# EAGLE schematic swarmbot (EAGLE 9.4.2)
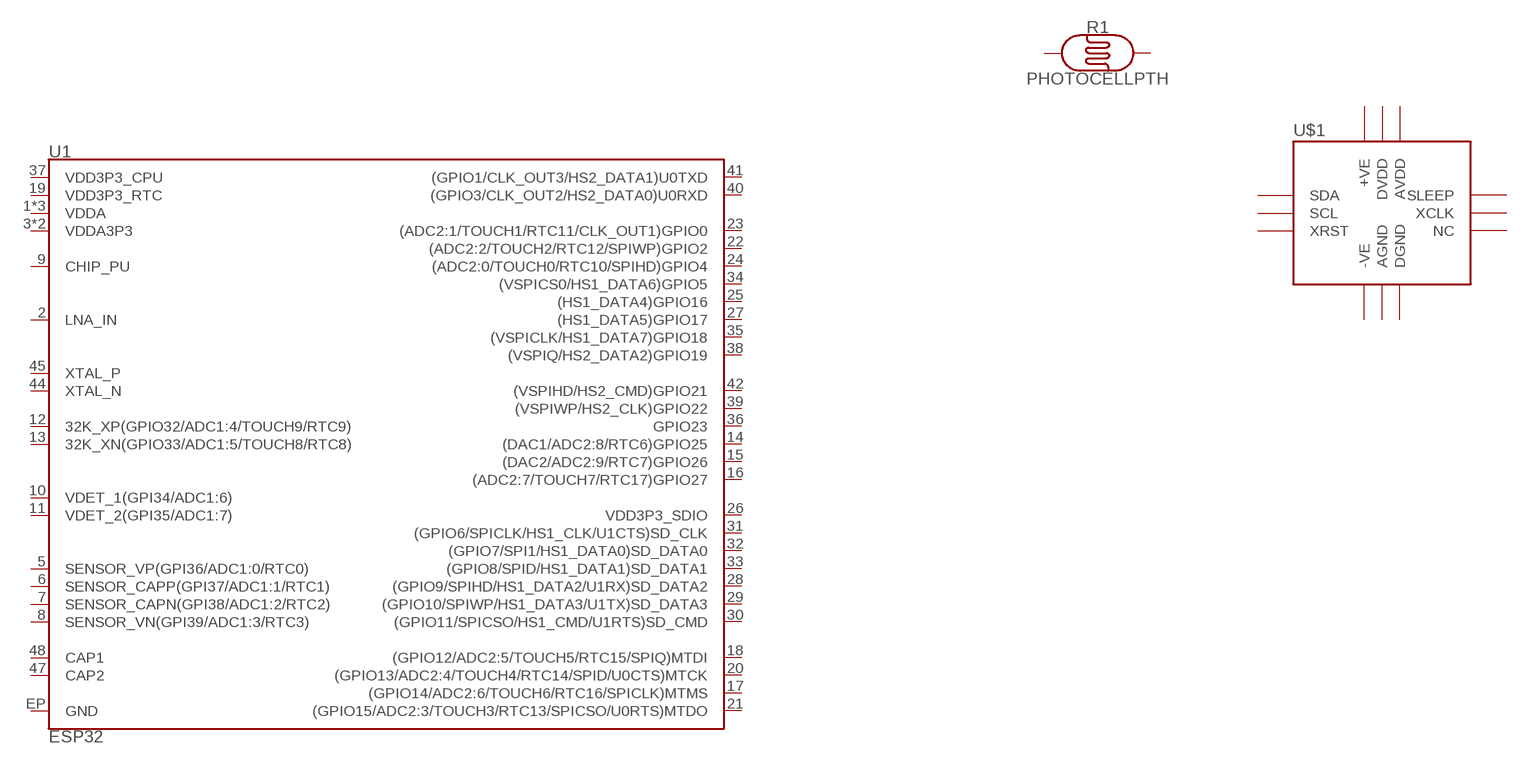
[diagram p0: schematic, sheet 1]

## Parts
R1  PHOTOCELLPTH  [PHOTOCELL]
U1  ESP32  [QFN48-0.4MM]
U$1  ADJD_COLOR_SENSOR_SMD  [ADJD-S371]
Unconnected: R1.1 R1.2 U1.1(VDDA) U1.2(LNA_IN) U1.3(VDDA3P3) U1.4(VDDA3P3) U1.5(SENSOR_VP(GPI36/ADC1:0/RTC0)) U1.6(SENSOR_CAPP(GPI37/ADC1:1/RTC1)) U1.7(SENSOR_CAPN(GPI38/ADC1:2/RTC2)) U1.8(SENSOR_VN(GPI39/ADC1:3/RTC3)) U1.9(CHIP_PU) U1.10(VDET_1(GPI34/ADC1:6)) U1.11(VDET_2(GPI35/ADC1:7)) U1.12(32K_XP(GPIO32/ADC1:4/TOUCH9/RTC9)) U1.13(32K_XN(GPIO33/ADC1:5/TOUCH8/RTC8)) U1.14((DAC1/ADC2:8/RTC6)GPIO25) U1.15((DAC2/ADC2:9/RTC7)GPIO26) U1.16((ADC2:7/TOUCH7/RTC17)GPIO27) U1.17((GPIO14/ADC2:6/TOUCH6/RTC16/SPICLK)MTMS) U1.18((GPIO12/ADC2:5/TOUCH5/RTC15/SPIQ)MTDI) U1.19(VDD3P3_RTC) U1.20((GPIO13/ADC2:4/TOUCH4/RTC14/SPID/U0CTS)MTCK) U1.21((GPIO15/ADC2:3/TOUCH3/RTC13/SPICSO/U0RTS)MTDO) U1.22((ADC2:2/TOUCH2/RTC12/SPIWP)GPIO2) U1.23((ADC2:1/TOUCH1/RTC11/CLK_OUT1)GPIO0) U1.24((ADC2:0/TOUCH0/RTC10/SPIHD)GPIO4) U1.25((HS1_DATA4)GPIO16) U1.26(VDD3P3_SDIO) U1.27((HS1_DATA5)GPIO17) U1.28((GPIO9/SPIHD/HS1_DATA2/U1RX)SD_DATA2) U1.29((GPIO10/SPIWP/HS1_DATA3/U1TX)SD_DATA3) U1.30((GPIO11/SPICSO/HS1_CMD/U1RTS)SD_CMD) U1.31((GPIO6/SPICLK/HS1_CLK/U1CTS)SD_CLK) U1.32((GPIO7/SPI1/HS1_DATA0)SD_DATA0) U1.33((GPIO8/SPID/HS1_DATA1)SD_DATA1) U1.34((VSPICS0/HS1_DATA6)GPIO5) U1.35((VSPICLK/HS1_DATA7)GPIO18) U1.36(GPIO23) U1.37(VDD3P3_CPU) U1.38((VSPIQ/HS2_DATA2)GPIO19) U1.39((VSPIWP/HS2_CLK)GPIO22) U1.40((GPIO3/CLK_OUT2/HS2_DATA0)U0RXD) U1.41((GPIO1/CLK_OUT3/HS2_DATA1)U0TXD) U1.42((VSPIHD/HS2_CMD)GPIO21) U1.43(VDDA) U1.44(XTAL_N) U1.45(XTAL_P) U1.46(VDDA) U1.47(CAP2) U1.48(CAP1) U1.EP(GND) U$1.1(-VE) U$1.2(NC) U$1.3(+VE) U$1.4(SDA) U$1.5(DVDD) U$1.6(SCL) U$1.7(AVDD) U$1.8(SLEEP) U$1.9(AGND) U$1.10(XRST) U$1.11(DGND) U$1.12(XCLK)

## Library data of the parts
R1 = SparkFun-Sensors:PHOTOCELL: Photocell (Photodetector, Photo Resistor, CdS) This is a very small light sensor. A photocell changes (also called a photodetector, photo resistor, CdS or photoconductive cell) resistance depending on the amount of light it is exposed to. These little sensors make great ambient light triggers (when light in the room turns on, do something). Datasheet <http://cdn.sparkfun.com/datasheets/Sensors/LightImaging/SEN-09088.pdf> SparkFun Products Mini Photocell <https://www.sparkfun.com/products/9088> (SEN-09088); PROD_ID: COMP-09129; SF_ID: SEN-09088
U1 = SparkFun-RF:ESP32: Espressif ESP32 WiFi-compatible SoC microcontroller. Bluetooth Low energy support (BLE, BT4.0, Bluetooth Smart) 28 GPIO pins Dual-core Tensilica LX6 microprocessor Hardware accelerated encryption (AES, SHA2, ECC, RSA-4096) 4MB Flash memory 520kB internal SRAM Datasheet <https://cdn.sparkfun.com/datasheets/IoT/esp32_datasheet_en.pdf> SparkFun Products: SparkFun ESP32 Thing <https://www.sparkfun.com/products/13907>; PROD_ID: IC-13338
U$1 = SparkFun:ADJD_COLOR_SENSOR: Color Light Sensor ADJD-S371 from Avago. Digital RGB light sensor (I2C) with on-board white LED. Not quite proven footprint or schematic component. SKU: COM-08618